# EAGLE design February (EAGLE 9.0.1)
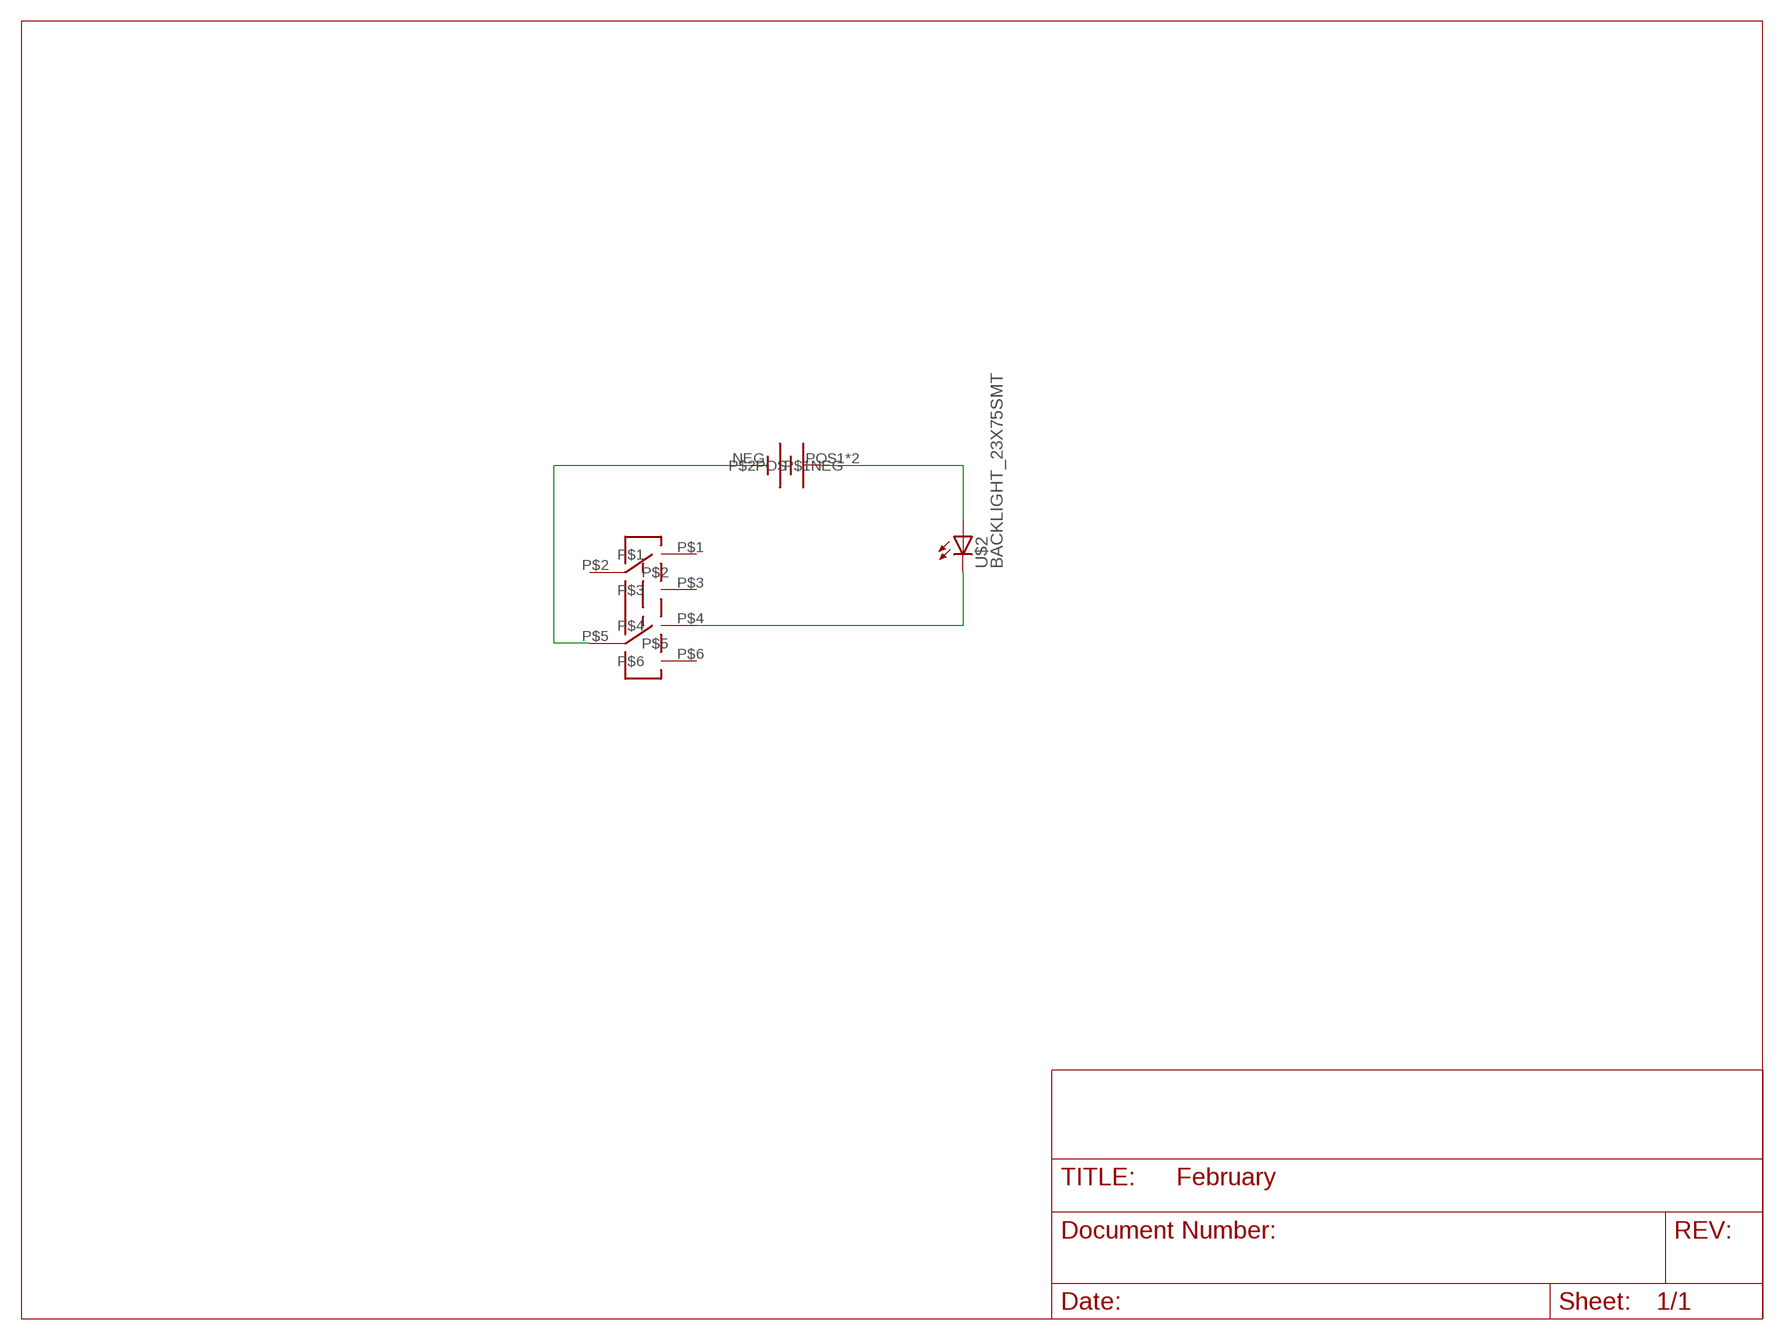
[diagram p0: schematic, sheet 1]

## Parts
U$1  JS202011SCQN  [JS202011SCQN]
U$2  BACKLIGHT_23X75SMT  [BACKLIGHT_23X75SMT]
U$3  BK-912  [BK-912]

## Nets
GND: U$1.P$5 U$3.NEG(P$1NEG)
N$2: U$2.LED+(A) U$3.POS1(P$2POS) U$3.POS2(P$2POS)
VBAT: U$1.P$4 U$2.LED-(C)
Unconnected: U$1.P$1 U$1.P$2 U$1.P$3 U$1.P$6

## Library data of the parts
U$1 = Switches:JS202011SCQN: J&K JS202011SCQN DPDT Gullwing
U$2 = LED:BACKLIGHT_23X75
U$3 = Batteries:BK-912

## Board
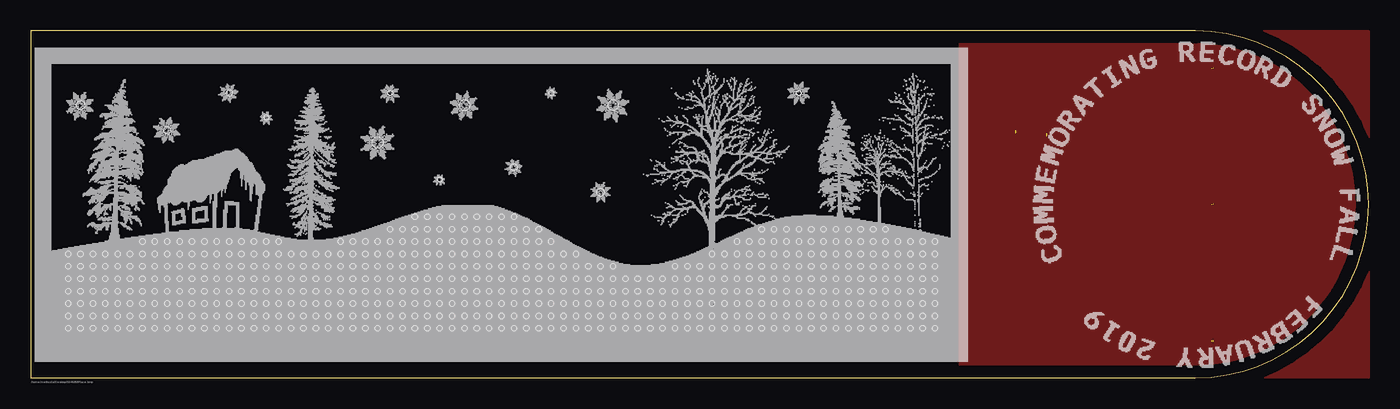
[diagram p1: board, top side]
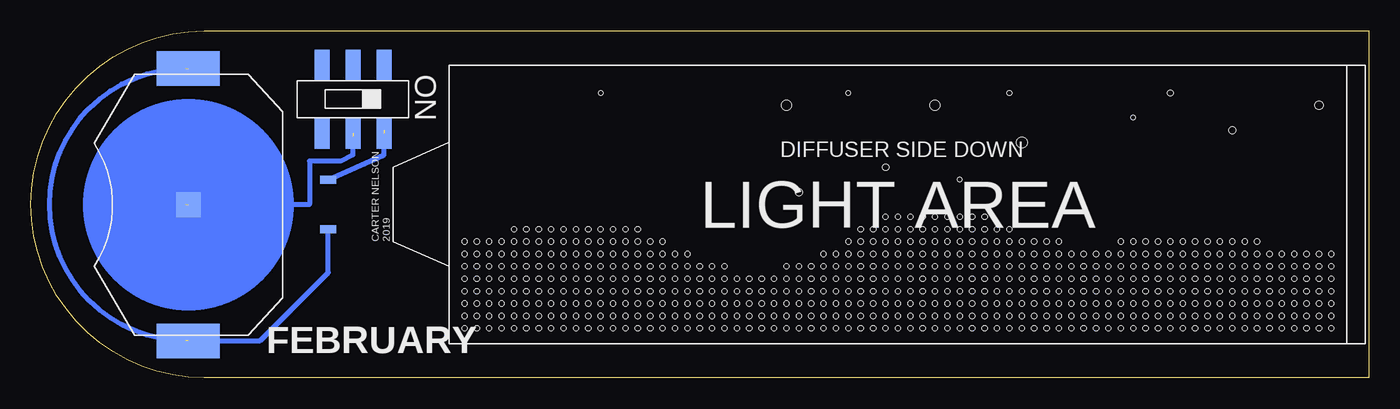
[diagram p2: board, bottom side, seen from below]

Size 108 x 28 mm. Coordinates in mm from the lower left corner, seen from the top.
Outline: 0,0 94,0 arc90 108,14 arc90 94,28 0,28 0,0
Copper layers (1*16): Top 0.035mm / dielectric 1.5mm / Bottom 0.035mm
Design rules "default": minimum track width 6mil, minimum drill 0.35mm, track to track 6mil, track to pad 6mil, pad to pad 6mil, via to via 6mil, smd to smd 6mil, copper to edge 40mil, drill to drill 6mil, minimum pad ring 10mil, minimum via ring 8mil, stop-mask expansion 4mil, vias tented up to drill 0mil, thermal gap 10mil
Holes 0.4 mm at 3,4 3,5 3,6 3,7 3,8 3,9 3,10 4,4 4,5 4,6 4,7 4,8 4,9 4,10 5,4 5,5 5,6 5,7 5,8 5,9 5,10 6,4 6,5 6,6 6,7 6,8 6,9 6,10 7,4 7,5 7,6 7,7 7,8 7,9 7,10 8,4 8,5 8,6 8,7 8,8 8,9 8,10 9,4 9,5 9,6 9,7 9,8 9,9 9,10 10,4 10,5 10,6 10,7 10,8 10,9 10,10 11,4 11,5 11,6 11,7 11,8 11,9 11,10 12,4 12,5 12,6 12,7 12,8 12,9 12,10 13,4 13,5 13,6 13,7 13,8 13,9 13,10 14,4 14,5 14,6 14,7 14,8 14,9 14,10 15,4 15,5 15,6 15,7 15,8 15,9 15,10 16,4 16,5 16,6 16,7 16,8 16,9 16,10 17,4 17,5 17,6 17,7 17,8 17,9 17,10 18,4 18,5 18,6 18,7 18,8 18,9 18,10 19,4 19,5 19,6 19,7 19,8 19,9 19,10 20,4 20,5 20,6 20,7 20,8 20,9 20,10 21,4 21,5 21,6 21,7 21,8 21,9 21,10 22,4 22,5 22,6 22,7 22,8 22,9 22,10 23,4 23,5 23,6 23,7 23,8 23,9 23,10 24,4 24,5 24,6 24,7 24,8 24,9 24,10 25,4 25,5 25,6 25,7 25,8 25,9 25,10 26,4 26,5 26,6 26,7 26,8 26,9 26,10 27,4 27,5 27,6 27,7 27,8 27,9 27,10 28,4 28,5 28,6 28,7 28,8 28,9 28,10 29,4 29,5 29,6 29,7 29,8 29,9 29,10 30,4 30,5 30,6 30,7 30,8 30,9 30,10 31,4 31,5 31,6 31,7 31,8 31,9 31,10 32,4 32,5 32,6 32,7 32,8 32,9 32,10 33,4 33,5 33,6 33,7 33,8 33,9 33,10 34,4 34,5 34,6 34,7 34,8 34,9 34,10 35,4 35,5 35,6 35,7 35,8 35,9 35,10 36,4 36,5 36,6 36,7 36,8 36,9 36,10 37,4 37,5 37,6 37,7 37,8 37,9 37,10 38,4 38,5 38,6 38,7 38,8 38,9 38,10 39,4 39,5 39,6 39,7 39,8 39,9 39,10 40,4 40,5 40,6 40,7 40,8 40,9 40,10 41,4 41,5 41,6 41,7 41,8 41,9 41,10 42,4 42,5 42,6 42,7 42,8 42,9 42,10 43,4 43,5 43,6 43,7 43,8 43,9 43,10 44,4 44,5 44,6 44,7 44,8 44,9 44,10 45,4 45,5 45,6 45,7 45,8 45,9 46,4 46,5 46,6 46,7 46,8 46,9 47,4 47,5 47,6 47,7 47,8 47,9 48,4 48,5 48,6 48,7 48,8 49,4 49,5 49,6 49,7 49,8 50,4 50,5 50,6 50,7 50,8 51,4 51,5 51,6 51,7 51,8 52,4 52,5 52,6 52,7 52,8 52,9 53,4 53,5 53,6 53,7 53,8 53,9 54,4 54,5 54,6 54,7 54,8 54,9 55,4 55,5 55,6 55,7 55,8 55,9 55,10 56,4 56,5 56,6 56,7 56,8 56,9 56,10 57,4 57,5 57,6 57,7 57,8 57,9 57,10 58,4 58,5 58,6 58,7 58,8 58,9 58,10 59,4 59,5 59,6 59,7 59,8 59,9 59,10 60,4 60,5 60,6 60,7 60,8 60,9 60,10 61,4 61,5 61,6 61,7 61,8 61,9 61,10 62,4 62,5 62,6 62,7 62,8 62,9 62,10 63,4 63,5 63,6 63,7 63,8 63,9 63,10 64,4 64,5 64,6 64,7 64,8 64,9 64,10 65,4 65,5 65,6 65,7 65,8 65,9 65,10 66,4 66,5 66,6 66,7 66,8 66,9 66,10 67,4 67,5 67,6 67,7 67,8 67,9 67,10 68,4 68,5 68,6 68,7 68,8 68,9 68,10 69,4 69,5 69,6 69,7 69,8 69,9 69,10 70,4 70,5 70,6 70,7 70,8 70,9 70,10 71,4 71,5 71,6 71,7 71,8 71,9 71,10 72,4 72,5 72,6 72,7 72,8 72,9 72,10 73,4 73,5 73,6 73,7 73,8 73,9 73,10 9,11 10,11 11,11 12,11 13,11 14,11 15,11 16,11 17,11 18,11 19,11 20,11 26,11 25,11 27,11 28,11 29,11 29,12 30,11 30,12 31,11 31,12 32,11 32,12 33,11 33,12 34,11 34,12 35,11 35,12 36,11 36,12 37,11 37,12 38,11 38,12 39,11 39,12 40,11 40,12 41,11 41,12 42,11 31,13 32,13 33,13 34,13 35,13 36,13 37,13 38,13 39,13 57,11 58,11 59,11 59,12 60,11 60,12 61,11 61,12 62,11 62,12 63,11 63,12 64,11 64,12 65,11 65,12 66,11 66,12 67,11 67,12 68,11 68,12 69,11 69,12 70,11 71,11 72,11 73,11
Holes 0.65 mm at 4,22
Holes 0.55 mm at 11,20 46,15
Holes 0.45 mm at 16,23
Holes 0.35 mm at 19,21 29,23 33,16 42,23 62,23
Holes 0.85 mm at 28,19
Holes 0.8 mm at 35,22 47,22
Holes 0.5 mm at 39,17

### Footprints (pad centres in the part's own frame; a part is rotated, then mirrored left to right if it is on the bottom)
JS202011SCQN = smd 1.2 x 2.5: P$1 -2.5,-2.75; P$2 0,-2.75; P$3 2.5,-2.75; P$4 -2.5,2.75; P$5 0,2.75; P$6 2.5,2.75
BACKLIGHT_23X75SMT = smd 1.27 x 0.635: LED+ 46,2; LED- 46,-2
BK-912 = smd 2 x 2: NEG 0,0 | smd 2.79 x 5.08: POS1 -10.985,0; POS2 10.985,0

### Placement (x,y rotation side)
U$1  82,22.5 180 bottom
U$2  38,14 180 bottom
U$3  95.29,13.97 270 bottom

### Tracks (layer width: path | path; a pad name or v marks a point on that pad's centre or on a via)
GND  (2 unrouted)
  Bottom 0.406: 95.5,14 85.5,14 85.5,17.5 83,17.5 82,18 82,19.5
N$1
  pour Top: 75,28 108,28 108,0 75,0
N$2  (2 unrouted)
  Bottom 0.406: U$2.LED+ 84,8.5 89.5,3 95.5,3 arc180 95.5,25
VBAT  (1 unrouted)
  Bottom 0.406: U$2.LED- 79.5,18 79.5,20

### Text on the board
tPlace: /home/methuzla/Desktop/02-FEB/tPlace.bmp
bPlace: ON | CARTER NELSON / 2019 | FEBRUARY
tStop: /home/methuzla/Desktop/02-FEB/tStop.bmp